# Altium project PCB_Project_STM32.PrjPcb
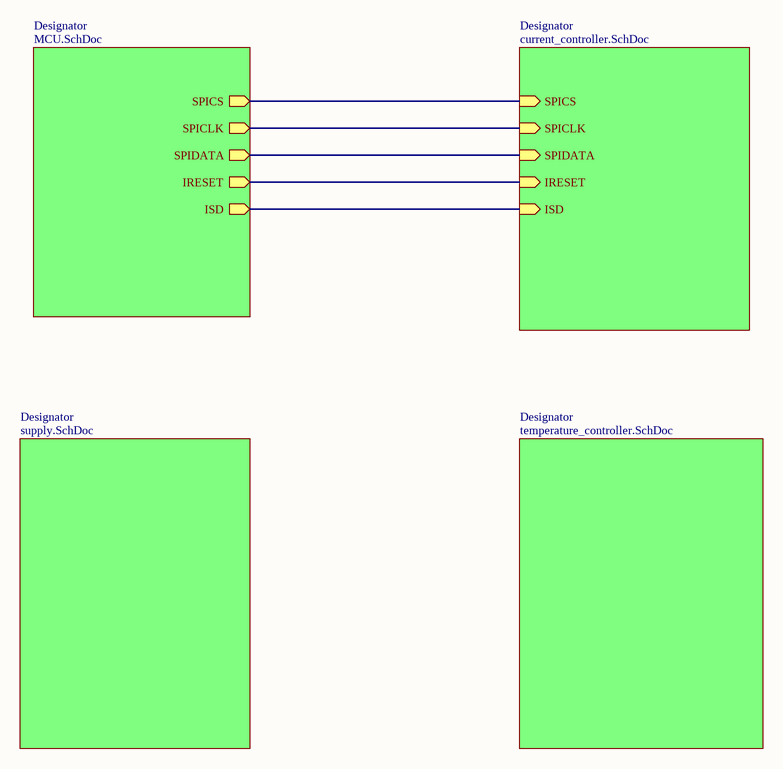
[diagram p0: TOP.SchDoc]
5 sheets, 105 parts. Net scope: hierarchical (ports join the sheet entries above them; power ports are global).
Sheets:
  TOP.SchDoc
    Designator = MCU.SchDoc
    Designator = current_controller.SchDoc
    Designator = supply.SchDoc
    Designator = temperature_controller.SchDoc

## Sheet TOP.SchDoc
size A

### Sub-sheets
Designator = MCU.SchDoc: SPICS (out), SPICLK (out), SPIDATA (out), IRESET (out), ISD (out)
Designator = current_controller.SchDoc: SPICS (in), SPICLK (in), SPIDATA (in), IRESET (in), ISD (in)
Designator = supply.SchDoc: no entries
Designator = temperature_controller.SchDoc: no entries

### Nets
NetU2_14: sheet Designator/IRESET, sheet Designator/IRESET
NetU2_15: sheet Designator/ISD, sheet Designator/ISD
NetU2_26: sheet Designator/SPICLK, sheet Designator/SPICLK
NetU2_27: sheet Designator/SPIDATA, sheet Designator/SPIDATA
NetU2_45: sheet Designator/SPICS, sheet Designator/SPICS

## Sheet MCU.SchDoc
size A3
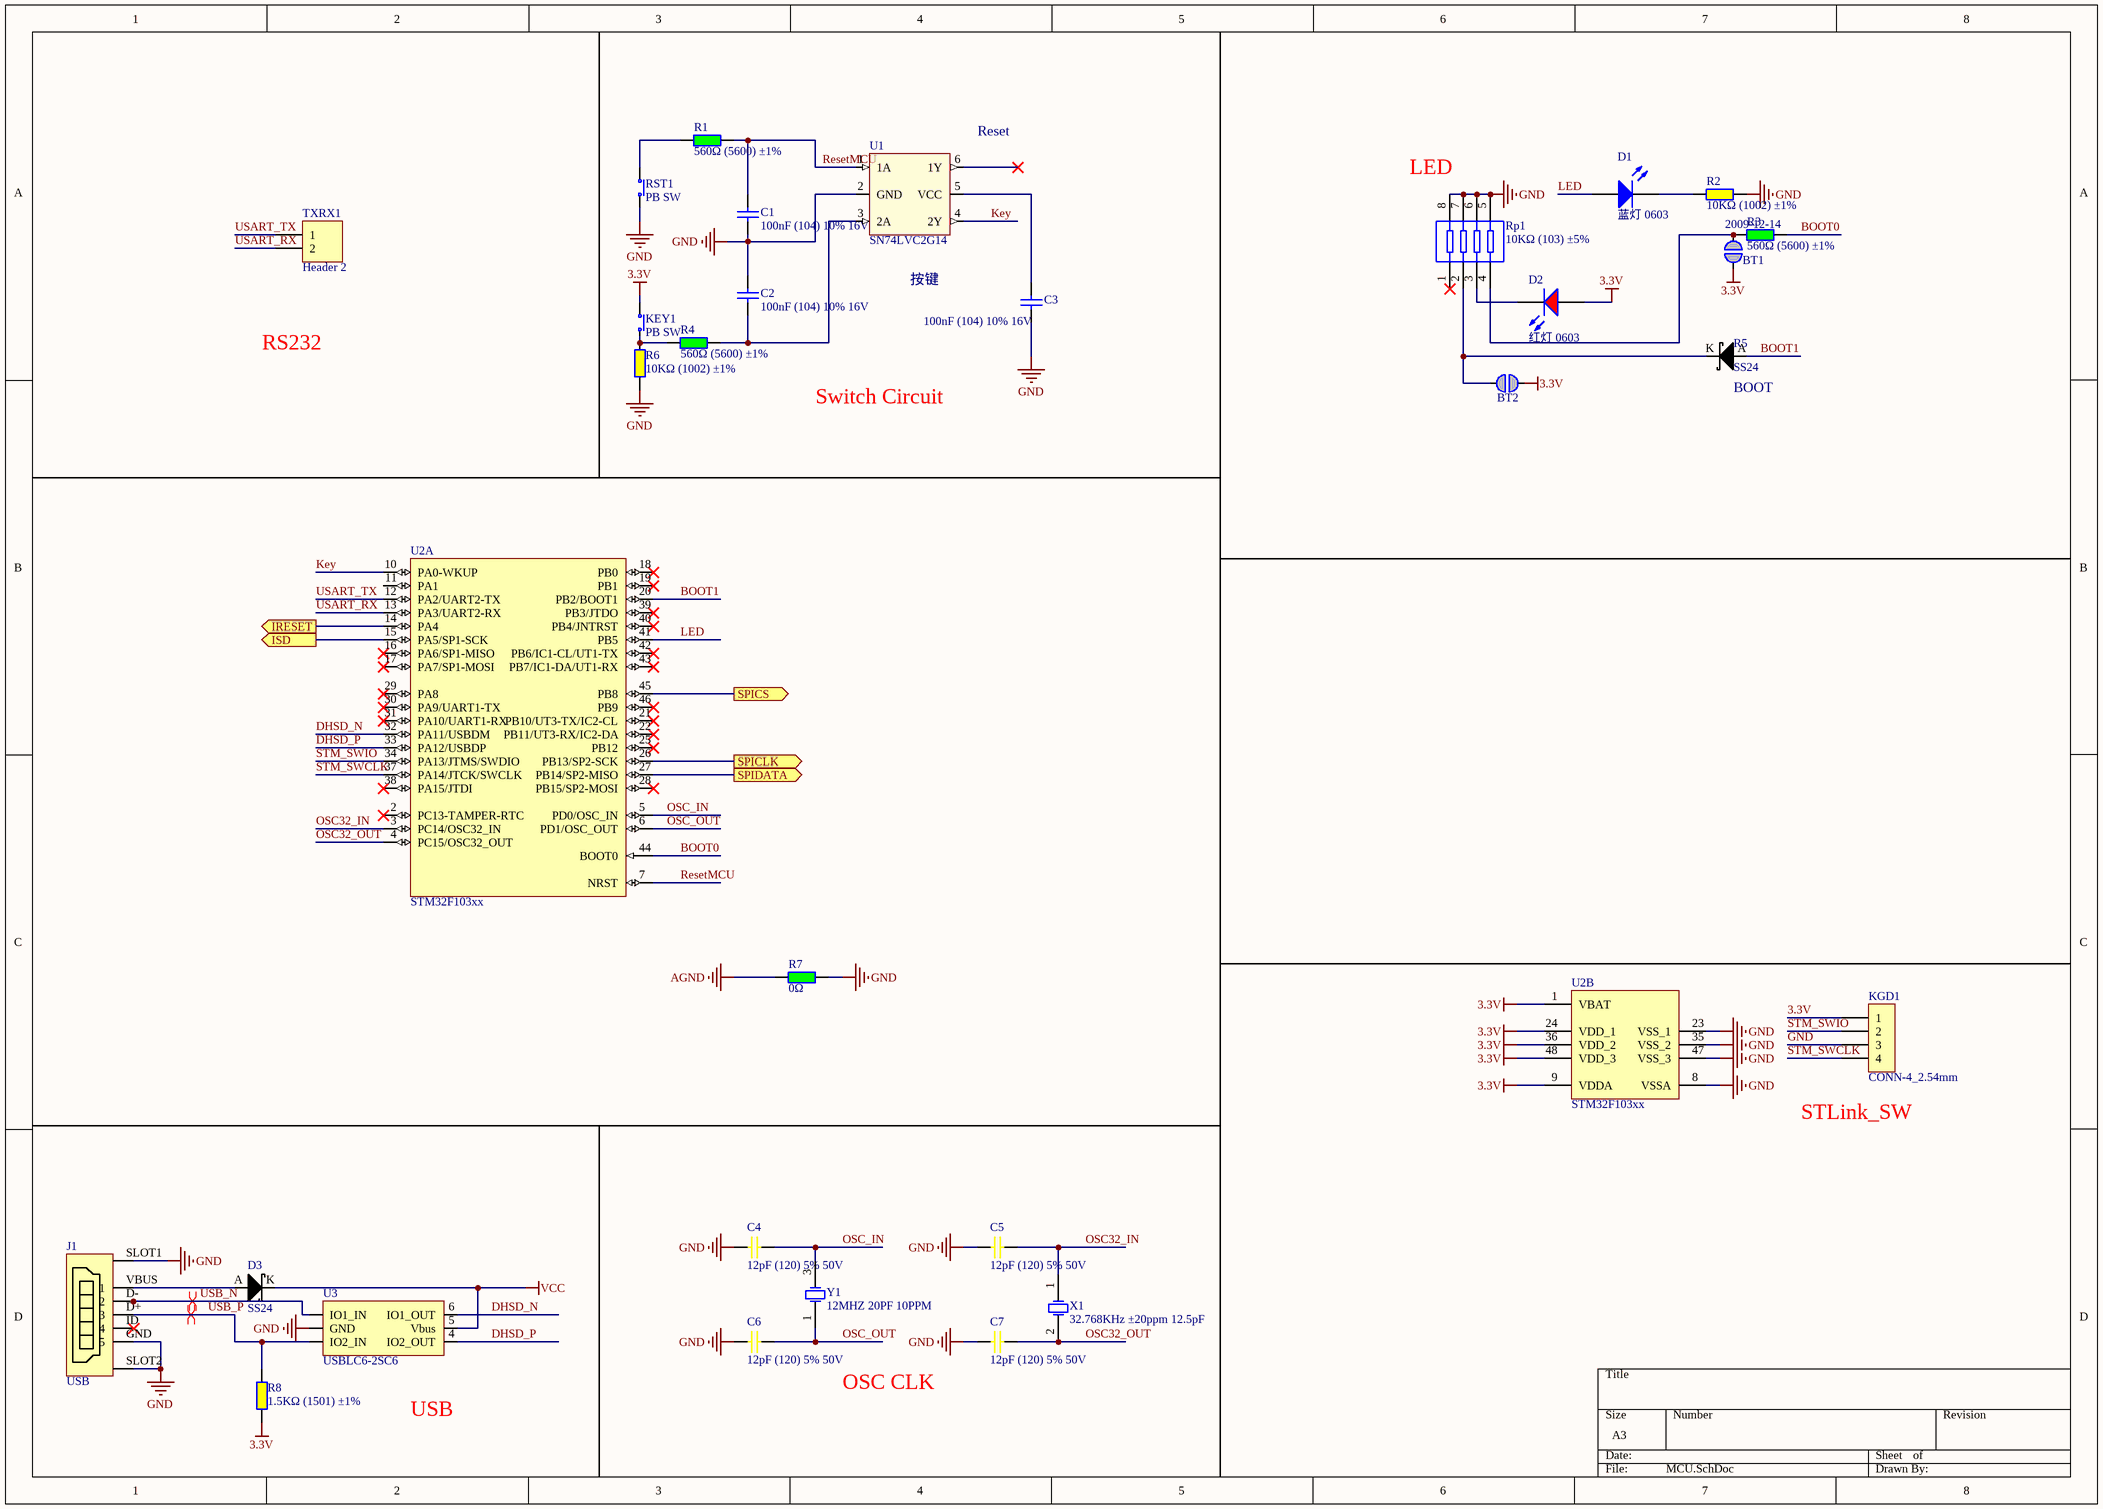
[diagram p1: MCU.SchDoc]

### Parts
BT1  LatestRevisionDate: 2009-12-14  [Solderbridge]  (hidden comment: Solderbridge)  (no BOM)
BT2  Solderbridge  [Solderbridge]  (value not drawn)  (no BOM)
C1  100nF (104) 10% 16V  [0402_C]
C2  100nF (104) 10% 16V  [0402_C]
C3  100nF (104) 10% 16V  [0402_C]
C4  12pF (120) 5% 50V  [0402_C]
C5  12pF (120) 5% 50V  [0402_C]
C6  12pF (120) 5% 50V  [0402_C]
C7  12pF (120) 5% 50V  [0402_C]
D1  蓝灯 0603  [0603_LED_S1]
D2  红灯 0603  [0603_LED_S1]
D3  SS24  [SMB-DIODE-DO214AA]
J1  USB  [MicroUSB_SMT]
KEY1  PB SW  [ALPS_SKHUxxx010_WO_GND]
KGD1  CONN-4_2.54mm  [CON4-2.54mm]
R1  560Ω (5600) ±1%  [0603_R]
R2  10KΩ (1002) ±1%  [0402_R]
R3  560Ω (5600) ±1%  [0603_R]
R4  560Ω (5600) ±1%  [0603_R]
R5  SS24  [SMB-DIODE-DO214AA]
R6  10KΩ (1002) ±1%  [0402_R]
R7  0Ω  [0603_R]
R8  1.5KΩ (1501) ±1%  [0402_R]
Rp1  10KΩ (103) ±5%  [0603_Rx4]
RST1  PB SW  [ALPS_SKHUxxx010_WO_GND]
TXRX1  Header 2  [HDR1X2]
U1  SN74LVC2G14  [SN74LVC2G14DBVR]
U2  STM32F103xx  [LQFP-48_7x7x05P]  (parts A,B of 2)
U3  USBLC6-2SC6  [SOT-23-6]
X1  32.768KHz ±20ppm 12.5pF  [SMD-3215_2P FC - 135]
Y1  12MHZ 20PF 10PPM  [SMD-3225_4P]

### Ports
IRESET (out), ISD (out), SPICLK (out), SPICS (out), SPIDATA (out)

### Nets
3.3V: BT1.2 BT2.1 D2.A KEY1.2(COM) KGD1.1 R8.1 U2.1(VBAT) U2.9(VDDA) U2.24(VDD_1) U2.36(VDD_2) U2.48(VDD_3)
AGND: R7.1
GND: C1.1 C2.2 C3.1 C4.1 C5.1 C6.1 C7.1 J1.GND(5) J1.SLOT1 J1.SLOT2 KGD1.3 R2.2 R6.1 R7.2 Rp1.5 Rp1.6 Rp1.7 Rp1.8 RST1.1(N.O) U1.2(GND) U2.8(VSSA) U2.23(VSS_1) U2.35(VSS_2) U2.47(VSS_3) U3.2(GND)
VCC: D3.K U3.5(Vbus)
BOOT0: R3.2 U2.44(BOOT0)
BOOT1: R5.A U2.20(PB2/BOOT1)
DHSD_N: U2.32(PA11/USBDM) U3.6(IO1_OUT)
DHSD_P: U2.33(PA12/USBDP) U3.4(IO2_OUT)
Key: U1.4(2Y) U2.10(PA0-WKUP)
LED: D1.A U2.41(PB5)
OSC32_IN: C5.2 U2.3(PC14/OSC32_IN) X1.1(OSC1)
OSC32_OUT: C7.2 U2.4(PC15/OSC32_OUT) X1.2(OSC2)
OSC_IN: C4.2 U2.5(PD0/OSC_IN) Y1.3(OSC2)
OSC_OUT: C6.2 U2.6(PD1/OSC_OUT) Y1.1(OSC1)
ResetMCU: C1.2 R1.2 U1.1(1A) U2.7(NRST)
STM_SWCLK: KGD1.4 U2.37(PA14/JTCK/SWCLK)
STM_SWIO: KGD1.2 U2.34(PA13/JTMS/SWDIO)
USART_RX: TXRX1.2 U2.13(PA3/UART2-RX)
USART_TX: TXRX1.1 U2.12(PA2/UART2-TX)
USB_N: J1.D-(2) U3.1(IO1_IN)
USB_P: J1.D+(3) R8.2 U3.3(IO2_IN)
NetBT1_1: BT1.1 R3.1 Rp1.4
NetBT2_2: BT2.2 R5.K Rp1.2
NetC2_1: C2.1 R4.2 U1.3(2A)
NetC3_2: C3.2 U1.5(VCC)
NetD1_K: D1.K R2.1
NetD2_K: D2.K Rp1.3
NetD3_A: D3.A J1.VBUS(1)
NetKEY1_1: KEY1.1(N.O) R4.1 R6.2
NetR1_1: R1.1 RST1.2(COM)
NetU2_14: U2.14(PA4) ; port IRESET
NetU2_15: U2.15(PA5/SP1-SCK) ; port ISD
NetU2_26: U2.26(PB13/SP2-SCK) ; port SPICLK
NetU2_27: U2.27(PB14/SP2-MISO) ; port SPIDATA
NetU2_45: U2.45(PB8) ; port SPICS

Not connected (* = marked no-connect by the designer): J1 ID(4)*; Rp1 1*; U1 6(1Y)*; U2 2(PC13-TAMPER-RTC)* 11(PA1) 16(PA6/SP1-MISO)* 17(PA7/SP1-MOSI)* 18(PB0)* 19(PB1)* 21(PB10/UT3-TX/IC2-CL)* 22(PB11/UT3-RX/IC2-DA)* 25(PB12)* 28(PB15/SP2-MOSI)* 29(PA8)* 30(PA9/UART1-TX)* 31(PA10/UART1-RX)* 38(PA15/JTDI)* 39(PB3/JTDO)* 40(PB4/JNTRST)* 42(PB6/IC1-CL/UT1-TX)* 43(PB7/IC1-DA/UT1-RX)* 46(PB9)*

### Layout directives
differential pair: USB_N, USB_P

### Notes on the sheet
- (near U1) Reset
- (near Rp1) LED
- (near U1) 按键
- RS232
- Switch Circuit
- (near R5) BOOT
- (near KGD1) STLink_SW
- OSC CLK
- USB

### Library data of the parts
BT2 = SOLDERBRIDGE: Artikkelnr Noca: N.A.; Part Number: Solderbridge; LatestRevisionDate: 2009-12-14; Pin Count: 2; Publisher: Nordic Semiconductor; Published: 2009-12-14; Value: Solderbridge
C1-C3 = 0402 100nF (104) 10% 16V: 贴片电容; ComponentLink1Description: 供应商链接; ComponentLink1URL: http://www.szlcsc.com/product/details_1877.html; Package: 0402; Supplier: LC; SuppliersPartNumber: C1525
C4-C7 = 0402 12pF (120) 5% 50V: 贴片电容; ComponentLink1Description: 供应商链接; ComponentLink1URL: http://www.szlcsc.com/product/details_1899.html; Package: 0402; Supplier: LC; SuppliersPartNumber: C1547
D1 = 0603 蓝灯: 发光二极管; Supplier: LC; SuppliersPartNumber: C72041; Package: 0603; ComponentLink1URL: http://www.szlcsc.com/product/details_73150.html; ComponentLink1Description: 供应商链接
D2 = 0603 红灯: 发光二极管; Supplier: LC; SuppliersPartNumber: C2286; Package: 0603; ComponentLink1URL: http://www.szlcsc.com/product/details_2659.html; ComponentLink1Description: 供应商链接
D3 R5 = SS24: SCHOTTKY DIODE; Manufacturer: Fairchild Semiconductor; Note: 40V 2A DO214AA; Manufacturer No: SS24; Supplier: LC; PartType: SM; ROHS: True; Pin Count: 2; SuppliersPartNumber: C64881; ComponentLink1URL: https://item.szlcsc.com/65951.html
J1 = USB: Micro-USB Type:B; Manufacturer: 精拓金; Manufacturer No: micro 5P全贴有柱无导位 平口外焊; Supplier: LC; SuppliersPartNumber: C77238; Pin Count: 6; ComponentLink1URL: https://item.szlcsc.com/78366.html
KEY1 RST1 = SW-PB_mouser: Switch; Manufacturer: 韩国韩荣; Manufacturer Part Number: K2-6639SP-C4SC-04; Note: 6.5x6.2x2.5mm; Pin Count: 4; Supplier: LC; SuppliersPartNumber: C83206; Package: SM; Value: PB SW; ComponentLink1URL: https://item.szlcsc.com/84370.html
KGD1 = CONN-4_2.54mm: 2.54mm 4pin through hole; ComponentLink1URL: https://item.szlcsc.com/125653.html; SuppliersPartNumber: C124378
R1 R3 R4 = 0603 560Ω (5600) 1%: 贴片电阻; ComponentLink1Description: 供应商链接; ComponentLink1URL: http://www.szlcsc.com/product/details_23931.html; Package: 0603; Supplier: LC; SuppliersPartNumber: C23204
R2 R6 = 0402 10KΩ (1002) 1%: 贴片电阻; ComponentLink1Description: 供应商链接; ComponentLink1URL: http://www.szlcsc.com/product/details_26487.html; Package: 0402; Supplier: LC; SuppliersPartNumber: C25744
R7 = 0603 0Ω: 贴片电阻; ComponentLink1Description: 供应商链接; ComponentLink1URL: https://item.szlcsc.com/424873.html; Package: 0603; Supplier: LC; SuppliersPartNumber: C429617
R8 = 0402 1.5KΩ (1501) 1%: 贴片电阻; ComponentLink1Description: 供应商链接; ComponentLink1URL: http://www.szlcsc.com/product/details_26610.html; Package: 0402; Supplier: LC; SuppliersPartNumber: C25867
Rp1 = 0603*4  10KΩ (103) 5%: 贴片排阻; ComponentLink1Description: 供应商链接; ComponentLink1URL: http://www.szlcsc.com/product/details_30472.html; Package: 0603*4; Supplier: LC; SuppliersPartNumber: C29718
TXRX1 = Header 2: Header, 2-Pin; LatestRevisionDate: 17-Jul-2002; LatestRevisionNote: Re-released for DXP Platform.; Publisher: Altium Limited
U1 = SN74LVC2G14: 74系列逻辑芯片; Manufacturer: TI; Note: Dual Schmitt-Trigger Inverter, 1.65V-6.5V 4.6ns,; Manufacturer No: SN74LVC2G14DBVR; Pins: 6; SuppliersPartNumber: C12401; Supplier: LC; ComponentLink1URL: https://item.szlcsc.com/13032.html
U2 = STM32F103xx: ARM; ComponentLink1Description: 供应商链接; ComponentLink1URL: http://www.szlcsc.com/product/details_9243.html; Package: LQFP-48_7x7x05P; Supplier: LC; SuppliersPartNumber: C8734
U3 = USBLC6-2SC6: ESD二极管（静电保护）; Manufacturer: ST; Supplier: LC; SuppliersPartNumber: C7519; Manufacturer No: USBLC6-2SC6; Package: SOT-23-6; ComponentLink1URL: https://item.szlcsc.com/7996.html
X1 = SMD-3215_2P 32.768KHz 20ppm 12.5pF: 贴片晶振; Supplier: LC; SuppliersPartNumber: C32346; ComponentLink1URL: http://www.szlcsc.com/product/details_33310.html; ComponentLink1Description: 供应商链接; Package: SMD-3215_2P
Y1 = SMD-3225_4P  12MHZ 20PF 10PPM: 贴片晶振; Package: SMD-3225_4P; SuppliersPartNumber: C9002; Supplier: LC; ComponentLink1URL: http://www.szlcsc.com/product/details_9522.html; ComponentLink1Description: 供应商链接
BT1 = SOLDERBRIDGE: Part Number: Solderbridge; Pin Count: 2; Publisher: Nordic Semiconductor; Published: 2009-12-14; Value: Solderbridge

## Sheet current_controller.SchDoc
size A3
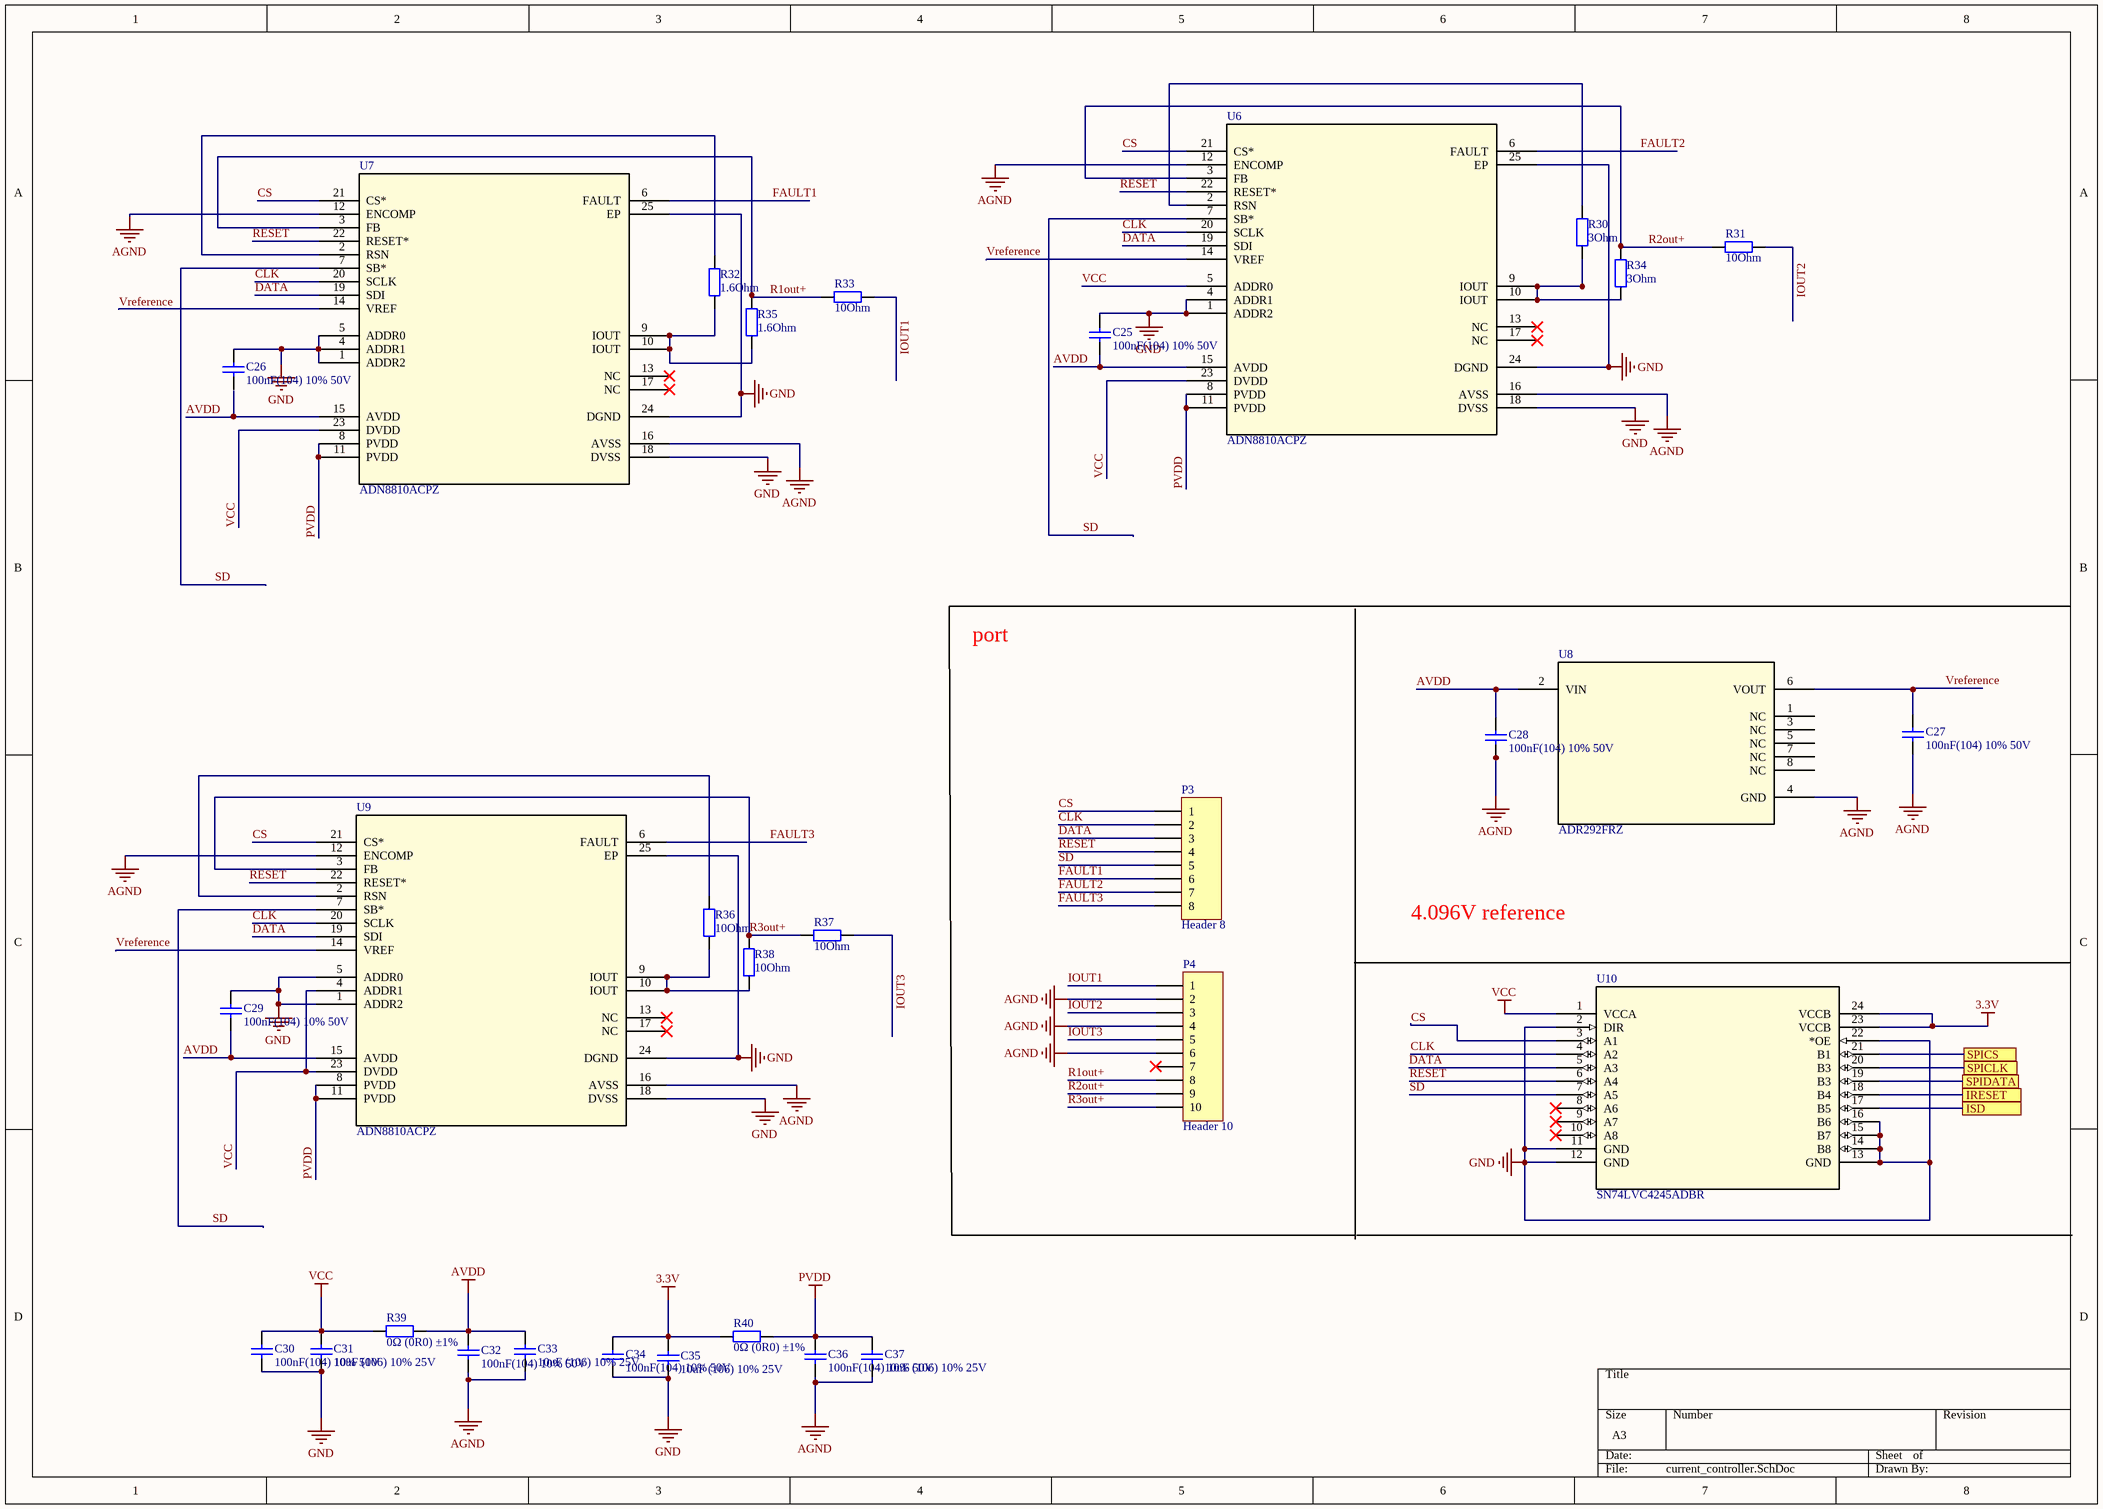
[diagram p2: current_controller.SchDoc]

### Parts
C25  100nF(104) 10% 50V  [0805_C]
C26  100nF(104) 10% 50V  [0805_C]
C27  100nF(104) 10% 50V  [0805_C]
C28  100nF(104) 10% 50V  [0805_C]
C29  100nF(104) 10% 50V  [0805_C]
C30  100nF(104) 10% 50V  [0805_C]
C31  10uF (106) 10% 25V  [0805_C]
C32  100nF(104) 10% 50V  [0805_C]
C33  10uF (106) 10% 25V  [0805_C]
C34  100nF(104) 10% 50V  [0805_C]
C35  10uF (106) 10% 25V  [0805_C]
C36  100nF(104) 10% 50V  [0805_C]
C37  10uF (106) 10% 25V  [0805_C]
P3  Header 8  [HDR1X8]
P4  Header 10  [HDR1X10]
R30  3Ohm  [AXIAL-0.4]
R31  10Ohm  [AXIAL-0.4]
R32  1.6Ohm  [AXIAL-0.4]
R33  10Ohm  [AXIAL-0.4]
R34  3Ohm  [AXIAL-0.4]
R35  1.6Ohm  [AXIAL-0.4]
R36  10Ohm  [AXIAL-0.4]
R37  10Ohm  [AXIAL-0.4]
R38  10Ohm  [AXIAL-0.4]
R39  0Ω (0R0) ±1%  [0603_R]
R40  0Ω (0R0) ±1%  [0603_R]
U6  ADN8810ACPZ  [CP_24_1]
U7  ADN8810ACPZ  [CP_24_1]
U8  ADR292FRZ  [R_8]
U9  ADN8810ACPZ  [CP_24_1]
U10  SN74LVC4245ADBR  [DB24]

### Ports
IRESET, ISD, SPICLK, SPICS, SPIDATA

### Nets
3.3V: C34.2 R40.1 U10.23(VCCB) U10.24(VCCB)
AGND: C27.1 C28.1 C32.2 C33.2 C36.2 C37.2 P4.2 P4.4 P4.6 U6.12(ENCOMP) U6.16(AVSS) U7.12(ENCOMP) U7.16(AVSS) U8.4(GND) U9.12(ENCOMP) U9.16(AVSS)
AVDD: C25.1 C28.2 C29.1 C33.1 R39.2 U6.15(AVDD) U7.15(AVDD) U8.2(VIN) U9.15(AVDD)
GND: C25.2 C26.2 C29.2 C30.2 C31.1 C34.1 C35.1 U6.1(ADDR2) U6.4(ADDR1) U6.18(DVSS) U6.24(DGND) U6.25(EP) U7.1(ADDR2) U7.4(ADDR1) U7.5(ADDR0) U7.18(DVSS) U7.24(DGND) U7.25(EP) U9.1(ADDR2) U9.5(ADDR0) U9.18(DVSS) U9.24(DGND) U9.25(EP) U10.2(DIR) U10.11(GND) U10.12(GND) U10.13(GND) U10.14(B8) U10.15(B7) U10.16(B6) U10.22(*OE)
PVDD: C36.1 C37.1 R40.2 U6.8(PVDD) U6.11(PVDD) U7.8(PVDD) U7.11(PVDD) U9.8(PVDD) U9.11(PVDD)
VCC: C30.1 C31.2 R39.1 U6.5(ADDR0) U6.23(DVDD) U7.23(DVDD) U9.4(ADDR1) U9.23(DVDD) U10.1(VCCA)
CLK: P3.2 U6.20(SCLK) U7.20(SCLK) U9.20(SCLK) U10.4(A2)
CS: P3.1 U6.21(CS*) U7.21(CS*) U9.21(CS*) U10.3(A1)
DATA: P3.3 U6.19(SDI) U7.19(SDI) U9.19(SDI) U10.5(A3)
FAULT1: P3.6 U7.6(FAULT)
FAULT2: P3.7 U6.6(FAULT)
FAULT3: P3.8 U9.6(FAULT)
IOUT1: P4.1 R33.1
IOUT2: P4.3 R31.1
IOUT3: P4.5 R37.1
R1out+: P4.8 R33.2 R35.2 U7.3(FB)
R2out+: P4.9 R31.2 R34.2 U6.3(FB)
R3out+: P4.10 R37.2 R38.2 U9.3(FB)
RESET: P3.4 U6.22(RESET*) U7.22(RESET*) U9.22(RESET*) U10.6(A4)
SD: P3.5 U6.7(SB*) U7.7(SB*) U9.7(SB*) U10.7(A5)
Vreference: C27.2 U6.14(VREF) U7.14(VREF) U8.6(VOUT) U9.14(VREF)
NetR30_1: R30.1 R34.1 U6.9(IOUT) U6.10(IOUT)
NetR30_2: R30.2 U6.2(RSN)
NetR32_1: R32.1 R35.1 U7.9(IOUT) U7.10(IOUT)
NetR32_2: R32.2 U7.2(RSN)
NetR36_1: R36.1 R38.1 U9.9(IOUT) U9.10(IOUT)
NetR36_2: R36.2 U9.2(RSN)
NetU2_14: U10.18(B4) ; port IRESET
NetU2_15: U10.17(B5) ; port ISD
NetU2_26: U10.20(B3) ; port SPICLK
NetU2_27: U10.19(B3) ; port SPIDATA
NetU2_45: U10.21(B1) ; port SPICS

Not connected (* = marked no-connect by the designer): C26 1; C32 1; C35 2; P4 7*; U6 13(NC)* 17(NC)*; U7 13(NC)* 17(NC)*; U8 1(NC) 3(NC) 5(NC) 7(NC) 8(NC); U9 13(NC)* 17(NC)*; U10 8(A6)* 9(A7)* 10(A8)*

### Notes on the sheet
- port
- 4.096V reference

### Library data of the parts
C25-C30 C32 C34 C36 = 0805 100nF(104) 10% 50V: 贴片电容; ComponentLink1Description: 供应商链接; ComponentLink1URL: http://www.szlcsc.com/product/details_50686.html; Package: 0805; Supplier: LC; SuppliersPartNumber: C49678
C31 C33 C35 C37 = 0805 10uF (106) 10% 25V: 贴片电容; ComponentLink1Description: 供应商链接; ComponentLink1URL: http://www.szlcsc.com/product/details_16532.html; Package: 0805; Supplier: LC; SuppliersPartNumber: C15850
P3 = Header 8: Header, 8-Pin; LatestRevisionDate: 17-Jul-2002; LatestRevisionNote: Re-released for DXP Platform.; Publisher: Altium Limited
P4 = Header 10: Header, 10-Pin; LatestRevisionDate: 17-Jul-2002; LatestRevisionNote: Re-released for DXP Platform.; Publisher: Altium Limited
R30 R34 = Res2: 1% resistance; Value: 3; Published: 8-Jun-2000; LatestRevisionDate: 17-Jul-2002; LatestRevisionNote: Re-released for DXP Platform.; PackageReference: AXIAL-0.4; Publisher: Altium Limited; PackageDescription: Axial Device, Thru-Hole; 2 Leads; 0.4 in Pin Spacing
R31 R33 R36-R38 = Res2: 1% resistance; Value: 10; Published: 8-Jun-2000; LatestRevisionDate: 17-Jul-2002; LatestRevisionNote: Re-released for DXP Platform.; PackageReference: AXIAL-0.4; Publisher: Altium Limited; PackageDescription: Axial Device, Thru-Hole; 2 Leads; 0.4 in Pin Spacing
R32 R35 = Res2: 1% resistance; Value: 1.6; Published: 8-Jun-2000; LatestRevisionDate: 17-Jul-2002; LatestRevisionNote: Re-released for DXP Platform.; PackageReference: AXIAL-0.4; Publisher: Altium Limited; PackageDescription: Axial Device, Thru-Hole; 2 Leads; 0.4 in Pin Spacing
R39 R40 = 0603 0Ω (0R0) 1%: 贴片电阻; ComponentLink1Description: 供应商链接; ComponentLink1URL: http://www.szlcsc.com/product/details_21903.html; Package: 0603; Supplier: LC; SuppliersPartNumber: C21189
U6 U7 U9 = ADN8810ACPZ: Imported; Manufacturer_Part_Number: ADN8810ACPZ; Vendor: Vendor; RefDes: Refdes; Type: Type; Value: Value
U8 = ADR292FRZ: Imported; Manufacturer_Part_Number: ADR292FRZ; Vendor: Vendor; RefDes: Refdes; Type: Type; Value: Value
U10 = SN74LVC4245ADBR: Octal Bus Transceiver And 3.3-V To 5-V Shifter With 3-State Outputs; Manufacturer: Texas Instruments; INDUSTRY_STD_PKG_TYPE: SSOP; FAMILY_NAME: DIRECTION CONTROL DUAL SUPPLY TRANSLATOR; PIN_COUNT: 24; PACKAGE_DESIGNATOR: DB; Datasheet_URL: http://www.ti.com/lit/gpn/SN74LVC4245A; GENERIC_PART_NUMBER: SN74LVC4245A; Vendor: Texas Instruments; Manufacturer_Part_Number: SN74LVC4245ADBR; Copyright: Copyright (C) 2018 Accelerated Designs. All rights reserved; RefDes: RefDes; Type: DEV

## Sheet supply.SchDoc
size A
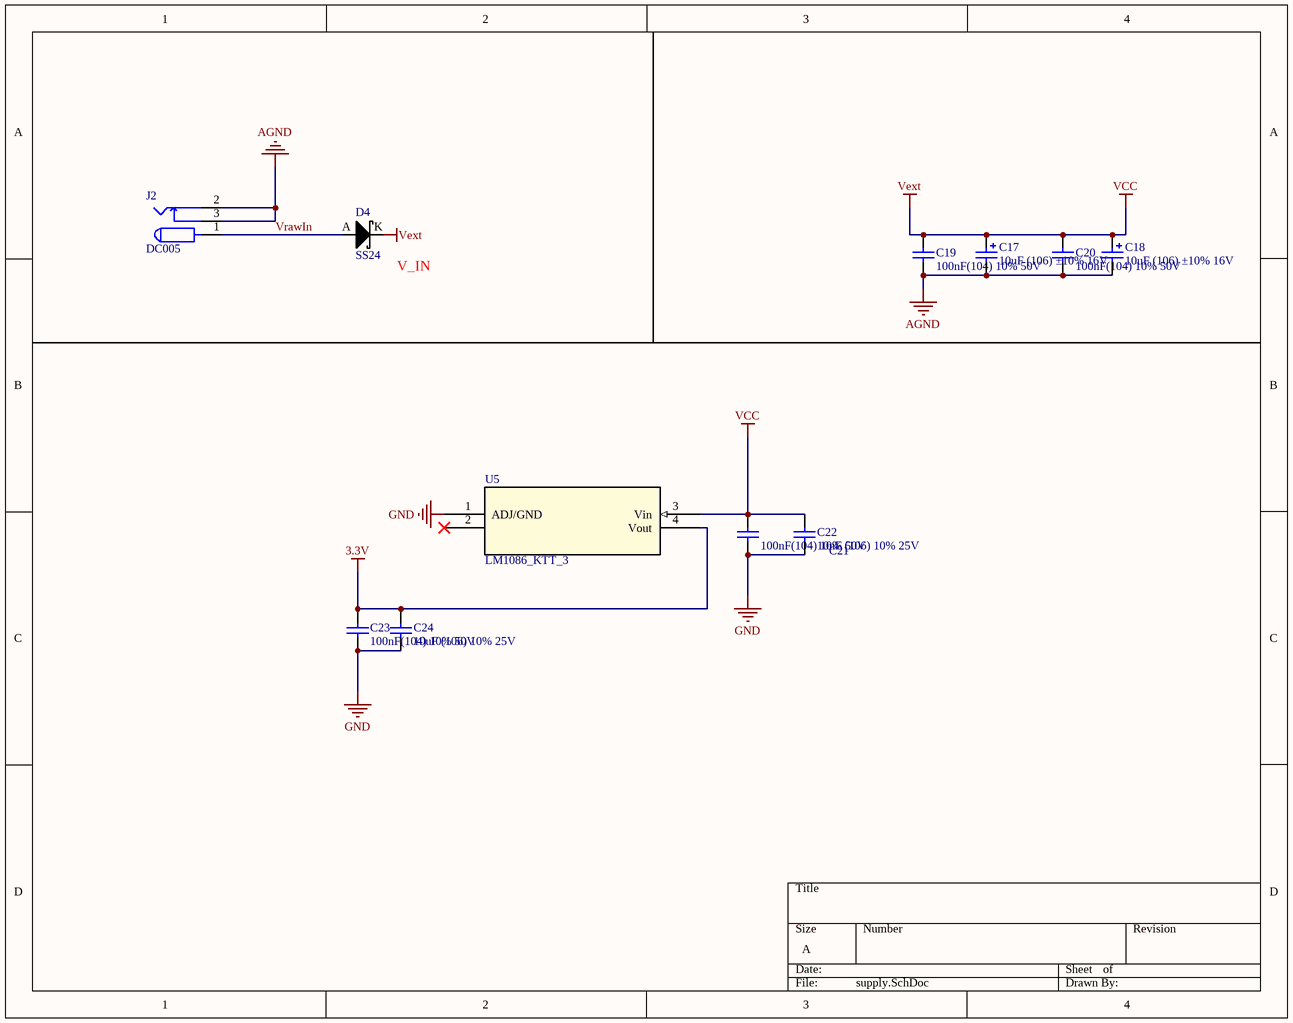
[diagram p3: supply.SchDoc]

### Parts
C17  10uF (106) ±10% 16V  [CASE-A_3216]
C18  10uF (106) ±10% 16V  [CASE-A_3216]
C19  100nF(104) 10% 50V  [0805_C]
C20  100nF(104) 10% 50V  [0805_C]
C21  100nF(104) 10% 50V  [0805_C]
C22  10uF (106) 10% 25V  [0805_C]
C23  100nF(104) 10% 50V  [0805_C]
C24  10uF (106) 10% 25V  [0805_C]
D4  SS24  [SMB-DIODE-DO214AA]
J2  DC005  [DC005]
U5  LM1086_KTT_3  [TS3B]

### Nets
3.3V: C23.1 C24.2 U5.4(Vout)
AGND: C17.2 C18.2 C19.1 C20.1 J2.2 J2.3
GND: C21.1 C22.1 C23.2 C24.1 U5.1(ADJ/GND)
VCC: C17.1 C18.1 C19.2 C20.2 C21.2 C22.2 D4.K U5.3(Vin)  [also labelled Vext]
VrawIn: D4.A J2.1

Not connected (* = marked no-connect by the designer): U5 2(Vout)*

### Notes on the sheet
- (near D4) V_IN

### Library data of the parts
C17 C18 = 3216 10uF (106) 10% 16V: 钽电容; ComponentLink1Description: 供应商链接; ComponentLink1URL: http://www.szlcsc.com/product/details_7643.html; Package: 3216; Supplier: LC; SuppliersPartNumber: C7171
C19-C21 C23 = 0805 100nF(104) 10% 50V: 贴片电容; ComponentLink1Description: 供应商链接; ComponentLink1URL: http://www.szlcsc.com/product/details_50686.html; Package: 0805; Supplier: LC; SuppliersPartNumber: C49678
C22 C24 = 0805 10uF (106) 10% 25V: 贴片电容; ComponentLink1Description: 供应商链接; ComponentLink1URL: http://www.szlcsc.com/product/details_16532.html; Package: 0805; Supplier: LC; SuppliersPartNumber: C15850
D4 = SS24: as D3 on sheet MCU; Manufacturer No: SS24; Supplier: LC; PartType: SM; ROHS: True; Pin Count: 2; SuppliersPartNumber: C64881; ComponentLink1URL: https://item.szlcsc.com/65951.html
U5 = LM1086_KTT_3: Imported; PartNumber: LM1086CS-25; Comp: TypeLDO; Vendor: NationalSemiconductor; base_pn: LM1086; Symbol: NameLM1086CS-25; Library: ReferenceLM1086CS; Type: LM1086CS-2.5; Version: 1; Pin: Count3; Value: Value; RefDes: RefDes

## Sheet temperature_controller.SchDoc
size A4
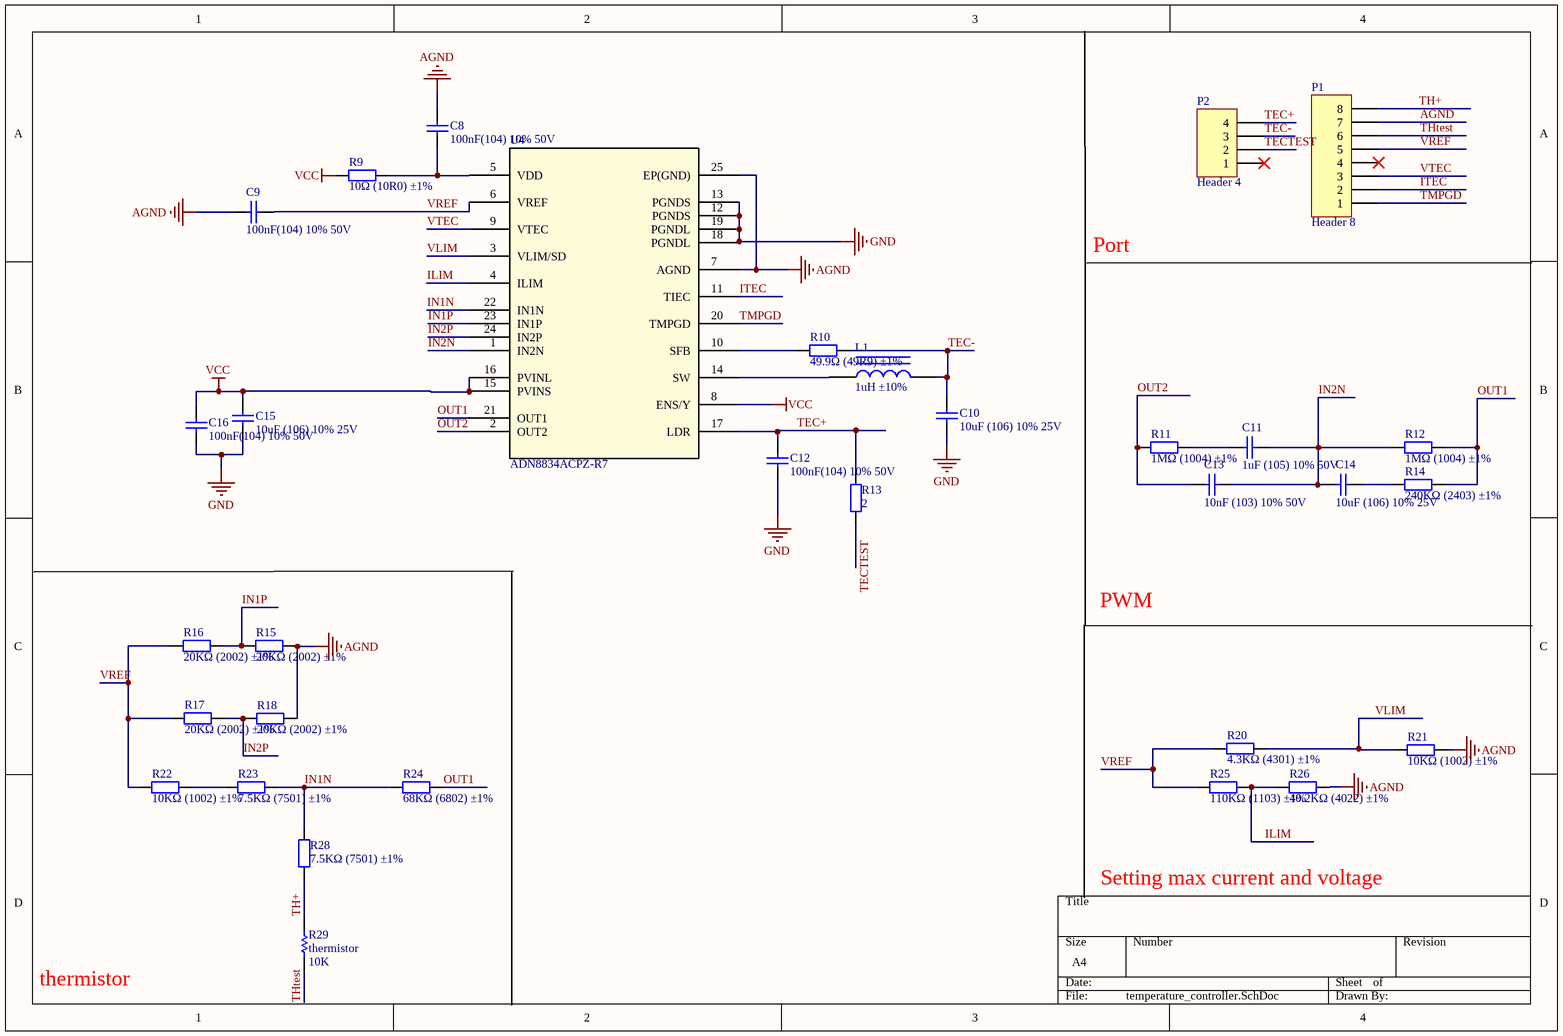
[diagram p4: temperature_controller.SchDoc]

### Parts
C8  100nF(104) 10% 50V  [0805_C]
C9  100nF(104) 10% 50V  [0805_C]
C10  10uF (106) 10% 25V  [0805_C]
C11  1uF (105) 10% 50V  [0805_C]
C12  100nF(104) 10% 50V  [0805_C]
C13  10nF (103) 10% 50V  [0805_C]
C14  10uF (106) 10% 25V  [0805_C]
C15  10uF (106) 10% 25V  [0805_C]
C16  100nF(104) 10% 50V  [0805_C]
L1  1uH ±10%  [0805_L]
P1  Header 8  [HDR1X8]
P2  Header 4  [HDR1X4]
R9  10Ω (10R0) ±1%  [0603_R]
R10  49.9Ω (49R9) ±1%  [0603_R]
R11  1MΩ (1004) ±1%  [0603_R]
R12  1MΩ (1004) ±1%  [0603_R]
R13  2  [AXIAL-0.4]
R14  240KΩ (2403) ±1%  [0603_R]
R15  20KΩ (2002) ±1%  [0603_R]
R16  20KΩ (2002) ±1%  [0603_R]
R17  20KΩ (2002) ±1%  [0603_R]
R18  20KΩ (2002) ±1%  [0603_R]
R20  4.3KΩ (4301) ±1%  [0603_R]
R21  10KΩ (1002) ±1%  [0603_R]
R22  10KΩ (1002) ±1%  [0603_R]
R23  7.5KΩ (7501) ±1%  [0603_R]
R24  68KΩ (6802) ±1%  [0603_R]
R25  110KΩ (1103) ±1%  [0603_R]
R26  40.2KΩ (4022) ±1%  [0603_R]
R28  7.5KΩ (7501) ±1%  [0603_R]
R29  thermistor  value 10K  [AXIAL-0.3]
U4  ADN8834ACPZ-R7  [CP_24_7]

### Nets
AGND: C8.2 C9.2 P1.7 R15.1 R18.1 R21.2 R26.2 U4.7(AGND) U4.25(EP(GND))
GND: C10.2 C12.1 C15.2 C16.2 U4.12(PGNDS) U4.13(PGNDS) U4.18(PGNDL) U4.19(PGNDL)
VCC: C15.1 C16.1 R9.1 U4.8(ENS/Y) U4.15(PVINS) U4.16(PVINL)
ILIM: R26.1 U4.4(ILIM)
IN1N: R23.1 R24.2 R28.2 U4.22(IN1N)
IN1P: R15.2 R16.2 U4.23(IN1P)
IN2N: C11.1 C13.1 C14.2 R12.1 U4.1(IN2N)
IN2P: R17.1 R18.2 U4.24(IN2P)
ITEC: P1.2 U4.11(TIEC)
OUT1: R12.2 R14.2 R24.1 U4.21(OUT1)
OUT2: C13.2 R11.1 U4.2(OUT2)
TEC+: C12.2 P2.4 R13.2 U4.17(LDR)
TEC-: C10.1 L1.2 P2.3 R10.2
TECTEST: P2.2 R13.1
TH+: P1.8 R28.1 R29.2
THtest: P1.6 R29.1
TMPGD: P1.1 U4.20(TMPGD)
VLIM: R20.2 R21.1 U4.3(VLIM/SD)
VREF: C9.1 P1.5 R16.1 R17.2 R20.1 R22.2 R25.1 U4.6(VREF)
VTEC: P1.3 U4.9(VTEC)
NetC8_1: C8.1 R9.2 U4.5(VDD)
NetC11_2: C11.2 R11.2
NetC14_1: C14.1 R14.1
NetL1_1: L1.1 U4.14(SW)
NetR10_1: R10.1 U4.10(SFB)
NetR22_1: R22.1 R23.2

Not connected (* = marked no-connect by the designer): P1 4*; P2 1*; R25 2

### Notes on the sheet
- Port
- PWM
- Setting max current and voltage
- thermistor

### Library data of the parts
C8 C9 C12 C16 = 0805 100nF(104) 10% 50V: 贴片电容; ComponentLink1Description: 供应商链接; ComponentLink1URL: http://www.szlcsc.com/product/details_50686.html; Package: 0805; Supplier: LC; SuppliersPartNumber: C49678
C10 C14 C15 = 0805 10uF (106) 10% 25V: 贴片电容; ComponentLink1Description: 供应商链接; ComponentLink1URL: http://www.szlcsc.com/product/details_16532.html; Package: 0805; Supplier: LC; SuppliersPartNumber: C15850
C11 = 0805 1uF (105) 10% 50V: 贴片电容; ComponentLink1Description: 供应商链接; ComponentLink1URL: http://www.szlcsc.com/product/details_29074.html; Package: 0805; Supplier: LC; SuppliersPartNumber: C28323
C13 = 0805 10nF (103) 10% 50V: 贴片电容; ComponentLink1Description: 供应商链接; ComponentLink1URL: http://www.szlcsc.com/product/details_2062.html; Package: 0805; Supplier: LC; SuppliersPartNumber: C1710
L1 = 0805 1uH 10%: 贴片电感; ComponentLink1Description: 供应商链接; ComponentLink1URL: http://www.szlcsc.com/product/details_1394.html; Package: 0805; Supplier: LC; SuppliersPartNumber: C1042
P1 = Header 8: Header, 8-Pin; LatestRevisionDate: 17-Jul-2002; LatestRevisionNote: Re-released for DXP Platform.; Publisher: Altium Limited
P2 = Header 4: Header, 4-Pin; LatestRevisionDate: 17-Jul-2002; LatestRevisionNote: Re-released for DXP Platform.; Publisher: Altium Limited
R9 = 0603 10Ω (10R0) 1%: 贴片电阻; ComponentLink1Description: 供应商链接; ComponentLink1URL: http://www.szlcsc.com/product/details_23586.html; Package: 0603; Supplier: LC; SuppliersPartNumber: C22859
R10 = 0603 49.9Ω (49R9) 1%: 贴片电阻; ComponentLink1Description: 供应商链接; ComponentLink1URL: http://www.szlcsc.com/product/details_23912.html; Package: 0603; Supplier: LC; SuppliersPartNumber: C23185
R11 R12 = 0603 1MΩ (1004) 1%: 贴片电阻; ComponentLink1Description: 供应商链接; ComponentLink1URL: http://www.szlcsc.com/product/details_23662.html; Package: 0603; Supplier: LC; SuppliersPartNumber: C22935
R13 = Res2: Resistor; Published: 8-Jun-2000; LatestRevisionDate: 17-Jul-2002; LatestRevisionNote: Re-released for DXP Platform.; PackageReference: AXIAL-0.4; Publisher: Altium Limited; PackageDescription: Axial Device, Thru-Hole; 2 Leads; 0.4 in Pin Spacing; Value: 2
R14 = 0603 240KΩ (2403) 1%: 贴片电阻; ComponentLink1Description: 供应商链接; ComponentLink1URL: http://www.szlcsc.com/product/details_4604.html; Package: 0603; Supplier: LC; SuppliersPartNumber: C4197
R15-R18 = 0603 20KΩ (2002) 1%: 贴片电阻; ComponentLink1Description: 供应商链接; ComponentLink1URL: http://www.szlcsc.com/product/details_4591.html; Package: 0603; Supplier: LC; SuppliersPartNumber: C4184
R20 = 0603 4.3KΩ (4301) 1%: 贴片电阻; ComponentLink1Description: 供应商链接; ComponentLink1URL: http://www.szlcsc.com/product/details_23886.html; Package: 0603; Supplier: LC; SuppliersPartNumber: C23159
R21 R22 = 0603 10KΩ (1002) 1%: 贴片电阻; ComponentLink1Description: 供应商链接; ComponentLink1URL: http://www.szlcsc.com/product/details_26547.html; Package: 0603; Supplier: LC; SuppliersPartNumber: C25804
R23 R28 = 0603 7.5KΩ (7501) 1%: 贴片电阻; ComponentLink1Description: 供应商链接; ComponentLink1URL: http://www.szlcsc.com/product/details_23961.html; Package: 0603; Supplier: LC; SuppliersPartNumber: C23234
R24 = 0603 68KΩ (6802) 1%: 贴片电阻; ComponentLink1Description: 供应商链接; ComponentLink1URL: http://www.szlcsc.com/product/details_23958.html; Package: 0603; Supplier: LC; SuppliersPartNumber: C23231
R25 = 0603 110KΩ (1103) 1%: 贴片电阻; ComponentLink1Description: 供应商链接; ComponentLink1URL: http://www.szlcsc.com/product/details_26548.html; Package: 0603; Supplier: LC; SuppliersPartNumber: C25805
R26 = 0603 40.2KΩ (4022) 1%: 贴片电阻; ComponentLink1Description: 供应商链接; ComponentLink1URL: http://www.szlcsc.com/product/details_13081.html; Package: 0603; Supplier: LC; SuppliersPartNumber: C12447
R29 = Res1: thermistor 1%; Published: 8-Jun-2000; LatestRevisionDate: 17-Jul-2002; LatestRevisionNote: Re-released for DXP Platform.; PackageReference: AXIAL-0.3; Publisher: Altium Limited; PackageDescription: Axial Device, Thru-Hole; 2 Leads; 0.3 in Pin Spacing
U4 = ADN8834ACPZ-R7: No Description Available; Copyright: Copyright (C) 2018 Accelerated Designs. All rights reserved; RefDes: RefDes; Type: DEV; Value: Value

## Nets that join several sheets
3.3V: MCU (11 pins), current_controller (C34.2 R40.1 U10.23 U10.24), supply (C23.1 C24.2 U5.4)
AGND: MCU (R7.1), current_controller (16 pins), supply (6 pins), temperature_controller (9 pins)
GND: MCU (25 pins), current_controller (31 pins), supply (5 pins), temperature_controller (8 pins)
VCC: MCU (D3.K U3.5), current_controller (9 pins), supply (8 pins), temperature_controller (6 pins)
NetU2_14: MCU (U2.14), current_controller (U10.18)
NetU2_15: MCU (U2.15), current_controller (U10.17)
NetU2_26: MCU (U2.26), current_controller (U10.20)
NetU2_27: MCU (U2.27), current_controller (U10.19)
NetU2_45: MCU (U2.45), current_controller (U10.21)